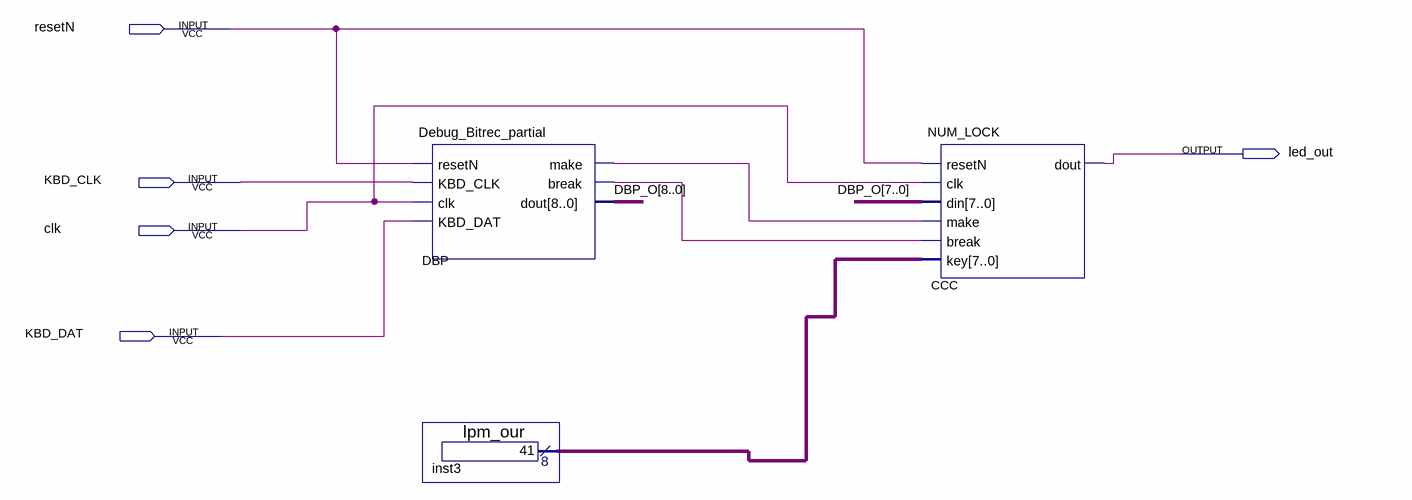
[diagram p0: schematic sheet]
// Quartus schematic KBDINTF.bdf as structural Verilog: 3 symbols, 5 pins
module KBDINTF (
  input  resetN,
  input  KBD_CLK,
  input  clk,
  input  KBD_DAT,
  output led_out
);

  wire DBP_break, DBP_make;
  wire [7:0] inst3_result;
  wire [8:0] DBP_O;

  Debug_Bitrec_partial DBP (
    .resetN(resetN), .KBD_CLK(KBD_CLK), .clk(clk), .KBD_DAT(KBD_DAT), .make(DBP_make), .\break (DBP_break),
    .dout(DBP_O));
  lpm_our inst3 (.result(inst3_result));
  NUM_LOCK CCC (
    .resetN(resetN), .clk(clk), .din(DBP_O[7:0]), .make(DBP_make), .\break (DBP_break), .key(inst3_result),
    .dout(led_out));
endmodule
